# Altium schematic sheet ESP32_USB_C.SchDoc (part 3 of 3)
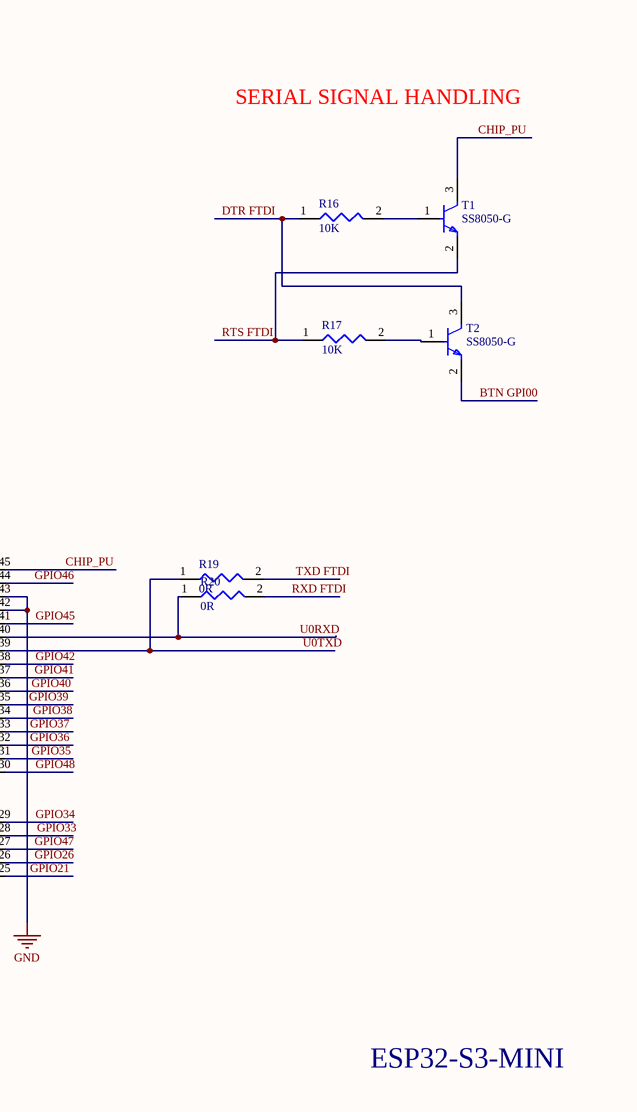
[diagram p5: ESP32_USB_C.SchDoc, bottom right]

## Library data of the parts (continued)
R1-R3 R19-R24 = RC0402JR-070RL: GENERAL PURPOSE CHIP RESISTOR Metal Glaze/thick Film, 0.0625W, 0ohm, Surface Mount, 0402; Manufacturer: Yageo Group; Max Power Dissipation: 63mW; Power Rating: 62.5mW; Value: 0Ω; Temperature Coefficient: 200ppm/°C; Tolerance: 5%; Voltage Rating: 50V; Supplier: DigiKey; Supplier Part Number: 311-0.0JRDKR-ND; Manufacturer Part Number: RC0402JR-070RL; RoHS: Compliant; Category: Chip SMD Resistors; Stock: 12335532; Pricing: 1=0.1, 10=0.010, 25=0.0064, 50=0.0056, 100=0.0048, 250=0.00404, 500=0.00356, 1000=0.00313, 5000=0.00237 (USD); Case/Package: 0402; Case Code (Imperial): 0402; China RoHS: Non-Compliant; Composition: Thick Film; Contact Plating: Tin; Depth: 500µm; Features: Moisture Resistant; Height: 350µm; Lead Free: Lead Free; Length: 1mm; Lifecycle Status: Production; Max Operating Temperature: 155°C; Military Standard: Not; Min Operating Temperature: -55°C; Mounting Technology: Surface Mount; Pins: 2; Number of Terminals: 2; Number of Terminations: 2; Packaging: Tape & Reel; Radiation Hardening: No; REACH SVHC: Yes; Schedule B: 8533290000, 8533290000|8533290000, 8533290000|8533290000|8533290000, 8533290000|8533290000|8533290000|8533290000; Termination: SMD/SMT; Voltage Rating (DC): 50V; Width: 500µm; ComponentLink1URL: https://datasheet.octopart.com:443/RC0402JR-070RL-Yageo-datasheet-182189538.pdf?src-supplier=IHS; ComponentLink1Description: https://datasheet.octopart.com:443/RC0402JR-070RL-Yageo-datasheet-182189538.pdf?src-supplier=IHS; ComponentLink2URL: https://datasheet.octopart.com:443/RC0402JR-070RL-Yageo-datasheet-10408619.pdf?src-supplier=Newark; ComponentLink2Description: https://datasheet.octopart.com:443/RC0402JR-070RL-Yageo-datasheet-10408619.pdf?src-supplier=Newark; ComponentLink3URL: https://datasheet.octopart.com:443/RC0402JR-070RL-Yageo-Group-datasheet-181964826.pdf?src-supplier=Newark; ComponentLink3Description: https://datasheet.octopart.com:443/RC0402JR-070RL-Yageo-Group-datasheet-181964826.pdf?src-supplier=Newark; ComponentLink4URL: https://datasheet.octopart.com:443/RC0402JR-070RL-Yageo-Group-datasheet-190305687.pdf?src-supplier=Future+Electronics; ComponentLink4Description: https://datasheet.octopart.com:443/RC0402JR-070RL-Yageo-Group-datasheet-190305687.pdf?src-supplier=Future+Electronics; ComponentLink5URL: https://datasheet.octopart.com:443/RC0402JR-070RL-Yageo-datasheet-164759695.pdf?src-supplier=Future+Electronics; ComponentLink5Description: https://datasheet.octopart.com:443/RC0402JR-070RL-Yageo-datasheet-164759695.pdf?src-supplier=Future+Electronics; ComponentLink6URL: https://datasheet.octopart.com:443/RC0402JR-070RL-Yageo-datasheet-137700087.pdf?src-supplier=Future+Electronics; ComponentLink6Description: https://datasheet.octopart.com:443/RC0402JR-070RL-Yageo-datasheet-137700087.pdf?src-supplier=Future+Electronics; ComponentLink7URL: https://datasheet.octopart.com:443/RC0402JR-070RL-Yageo-datasheet-12531192.pdf?src-supplier=Seeed+Studio; ComponentLink7Description: https://datasheet.octopart.com:443/RC0402JR-070RL-Yageo-datasheet-12531192.pdf?src-supplier=Seeed+Studio; ComponentLink8URL: https://datasheet.octopart.com:443/RC0402JR-070RL-Yageo-datasheet-8324527.pdf?src-supplier=TME; ComponentLink8Description: https://datasheet.octopart.com:443/RC0402JR-070RL-Yageo-datasheet-8324527.pdf?src-supplier=TME; ComponentLink9URL: https://datasheet.octopart.com:443/RC0402JR-070RL-Yageo-datasheet-62067350.pdf?src-supplier=Farnell; ComponentLink9Description: https://datasheet.octopart.com:443/RC0402JR-070RL-Yageo-datasheet-62067350.pdf?src-supplier=Farnell; ComponentLink10URL: https://datasheet.octopart.com:443/RC0402JR-070RL-Yageo-datasheet-8329306.pdf?src-supplier=element14; ComponentLink10Description: https://datasheet.octopart.com:443/RC0402JR-070RL-Yageo-datasheet-8329306.pdf?src-supplier=element14; ComponentLink11URL: https://datasheet.octopart.com:443/RC0402JR-070RL-Yageo-datasheet-505231.pdf?src-supplier=element14; ComponentLink11Description: https://datasheet.octopart.com:443/RC0402JR-070RL-Yageo-datasheet-505231.pdf?src-supplier=element14; ComponentLink12URL: https://datasheet.octopart.com:443/RC0402JR-070RL-Yageo-datasheet-175423674.pdf?src-supplier=SOS+electronic; ComponentLink12Description: https://datasheet.octopart.com:443/RC0402JR-070RL-Yageo-datasheet-175423674.pdf?src-supplier=SOS+electronic; ComponentLink13URL: https://datasheet.octopart.com/RC0402JR-070RL-Yageo-datasheet-73766026.pdf; ComponentLink13Description: https://datasheet.octopart.com/RC0402JR-070RL-Yageo-datasheet-73766026.pdf; ComponentLink14URL: http://sigma.octopart.com:80/conflict_mineral_statement/Yageo-company-3.pdf?src-supplier=Compliance+Statements; ComponentLink14Description: http://sigma.octopart.com:80/conflict_mineral_statement/Yageo-company-3.pdf?src-supplier=Compliance+Statements; ComponentLink15URL: http://sigma.octopart.com:80/rohs_statement/Yageo-company-2.pdf?src-supplier=Compliance+Statements; ComponentLink15Description: http://sigma.octopart.com:80/rohs_statement/Yageo-company-2.pdf?src-supplier=Compliance+Statements
R4 R6 = AC0603FR-101KL: Fixed Resistor, Metal Glaze/thick Film, 0.1W, 1000ohm, 75V, 1% +/-Tol, 100ppm/Cel, Surface Mount, 0603; Manufacturer: Yageo Group; Power Rating: 100mW; Value: 1kΩ; Temperature Coefficient: 100ppm/°C; Supplier: DigiKey; Supplier Part Number: 13-AC0603FR-101KLDKR-ND; Manufacturer Part Number: AC0603FR-101KL; RoHS: Compliant; Category: Chip SMD Resistors; Stock: 46779; Pricing: 1=0.1, 10=0.028, 25=0.0204, 50=0.0164, 100=0.0134, 250=0.01036, 500=0.00868, 1000=0.00735, 5000=0.00527 (USD); Case/Package: 0603; Case Code (Imperial): 0603; Case Code (Metric): 1608; China RoHS: Non-Compliant; Composition: Thick Film; Country of Origin: Mainland China, Taiwan; Export Control Classification Number (ECCN) Code: EAR99; Height: 450µm; Harmonized Tariff Schedule (HTS) Code: 8533.21.00.30; Introduction Date: 2012-04-10; Length: 1.6mm; Lifecycle Status: Production; Max Operating Temperature: 155°C; Min Operating Temperature: -55°C; Mounting Technology: Surface Mount; Number of Terminals: 2; Packaging: Tape & Reel; Ratings: AEC-Q200; REACH SVHC: Yes; Termination: SMD/SMT; Tolerance: 1%; Voltage Rating: 75V; Width: 800µm; Working Voltage: 75V; ComponentLink1URL: https://datasheet.octopart.com:443/AC0603FR-101KL-Yageo-datasheet-182189377.pdf?src-supplier=IHS; ComponentLink1Description: https://datasheet.octopart.com:443/AC0603FR-101KL-Yageo-datasheet-182189377.pdf?src-supplier=IHS; ComponentLink2URL: https://datasheet.octopart.com:443/AC0603FR-101KL-Yageo-datasheet-86786639.pdf?src-supplier=Upverter; ComponentLink2Description: https://datasheet.octopart.com:443/AC0603FR-101KL-Yageo-datasheet-86786639.pdf?src-supplier=Upverter; ComponentLink3URL: https://datasheet.octopart.com:443/AC0603FR-101KL-Yageo-datasheet-178509465.pdf?src-supplier=Newark; ComponentLink3Description: https://datasheet.octopart.com:443/AC0603FR-101KL-Yageo-datasheet-178509465.pdf?src-supplier=Newark; ComponentLink4URL: https://datasheet.octopart.com:443/AC0603FR-101KL-Yageo-datasheet-166720450.pdf?src-supplier=Future+Electronics; ComponentLink4Description: https://datasheet.octopart.com:443/AC0603FR-101KL-Yageo-datasheet-166720450.pdf?src-supplier=Future+Electronics; ComponentLink5URL: https://datasheet.octopart.com:443/AC0603FR-101KL-Yageo-datasheet-164768995.pdf?src-supplier=Future+Electronics; ComponentLink5Description: https://datasheet.octopart.com:443/AC0603FR-101KL-Yageo-datasheet-164768995.pdf?src-supplier=Future+Electronics; ComponentLink6URL: https://datasheet.octopart.com/AC0603FR-101KL-Yageo-datasheet-12512238.pdf; ComponentLink6Description: https://datasheet.octopart.com/AC0603FR-101KL-Yageo-datasheet-12512238.pdf; ComponentLink7URL: http://sigma.octopart.com:80/conflict_mineral_statement/Yageo-company-3.pdf?src-supplier=Compliance+Statements; ComponentLink7Description: http://sigma.octopart.com:80/conflict_mineral_statement/Yageo-company-3.pdf?src-supplier=Compliance+Statements; ComponentLink8URL: http://sigma.octopart.com:80/rohs_statement/Yageo-company-2.pdf?src-supplier=Compliance+Statements; ComponentLink8Description: http://sigma.octopart.com:80/rohs_statement/Yageo-company-2.pdf?src-supplier=Compliance+Statements
R5 R8 R25 R26 = RC0402FR-0727RL: 62.5mW Thick Film Resistors 50V ±100ppm/℃ ±1% 27Ω 0402 Chip Resistor - Surface Mount ROHS; Manufacturer: Yageo Group; Max Power Dissipation: 63mW; Temperature Coefficient: 100ppm/°C; Supplier: DigiKey; Supplier Part Number: YAG3086TR-ND; Manufacturer Part Number: RC0402FR-0727RL; RoHS: Compliant; Category: Chip SMD Resistors; Stock: 137651; Pricing: 10000=0.0031, 20000=0.00275, 30000=0.00257, 50000=0.00239, 70000=0.00228, 100000=0.00218 (USD); Case/Package: 0402; Case Code (Imperial): 0402; Case Code (Metric): 1005; China RoHS: Non-Compliant; Composition: Thick Film; Country of Origin: Mainland China, Taiwan; Depth: 500µm; Export Control Classification Number (ECCN) Code: EAR99; Features: Moisture Resistant; Height: 350µm; Harmonized Tariff Schedule (HTS) Code: 8533.21.00.30; Introduction Date: 2008-07-18; Lead Free: Lead Free; Length: 1mm; Lifecycle Status: Production; Max Operating Temperature: 155°C; Military Standard: Not; Min Operating Temperature: -55°C; Mounting Technology: Surface Mount; Pins: 2; Number of Terminals: 2; Number of Terminations: 2; Power Rating: 62.5mW; REACH SVHC: Yes; Value: 27Ω; Schedule B: 8533210045, 8533210045|8533210045, 8533210045|8533210045|8533210045, 8533210045|8533210045|8533210045|8533210045; Termination: SMD/SMT; Tolerance: 1%; Voltage Rating: 50V; Voltage Rating (AC): 50V; Voltage Rating (DC): 50V; Weight: 652.039032µg; Width: 500µm; Working Voltage: 50V; ComponentLink1URL: https://datasheet.octopart.com:443/RC0402FR-0727RL-Yageo-datasheet-175887523.pdf?src-supplier=Newark; ComponentLink1Description: https://datasheet.octopart.com:443/RC0402FR-0727RL-Yageo-datasheet-175887523.pdf?src-supplier=Newark; ComponentLink2URL: https://datasheet.octopart.com:443/RC0402FR-0727RL-Yageo-datasheet-8324527.pdf?src-supplier=Newark; ComponentLink2Description: https://datasheet.octopart.com:443/RC0402FR-0727RL-Yageo-datasheet-8324527.pdf?src-supplier=Newark; ComponentLink3URL: https://datasheet.octopart.com:443/RC0402FR-0727RL-Yageo-datasheet-103092701.pdf?src-supplier=Upverter; ComponentLink3Description: https://datasheet.octopart.com:443/RC0402FR-0727RL-Yageo-datasheet-103092701.pdf?src-supplier=Upverter; ComponentLink4URL: https://datasheet.octopart.com:443/RC0402FR-0727RL-Yageo-datasheet-10408619.pdf?src-supplier=element14+APAC; ComponentLink4Description: https://datasheet.octopart.com:443/RC0402FR-0727RL-Yageo-datasheet-10408619.pdf?src-supplier=element14+APAC; ComponentLink5URL: https://datasheet.octopart.com:443/RC0402FR-0727RL-Yageo-datasheet-62067350.pdf?src-supplier=element14+APAC; ComponentLink5Description: https://datasheet.octopart.com:443/RC0402FR-0727RL-Yageo-datasheet-62067350.pdf?src-supplier=element14+APAC; ComponentLink6URL: https://datasheet.octopart.com:443/RC0402FR-0727RL-Yageo-Group-datasheet-189192902.pdf?src-supplier=LCSC; ComponentLink6Description: https://datasheet.octopart.com:443/RC0402FR-0727RL-Yageo-Group-datasheet-189192902.pdf?src-supplier=LCSC; ComponentLink7URL: https://datasheet.octopart.com:443/RC0402FR-0727RL-Yageo-Group-datasheet-176638170.pdf?src-supplier=Future+Electronics; ComponentLink7Description: https://datasheet.octopart.com:443/RC0402FR-0727RL-Yageo-Group-datasheet-176638170.pdf?src-supplier=Future+Electronics; ComponentLink8URL: https://datasheet.octopart.com:443/RC0402FR-0727RL-Yageo-datasheet-164759695.pdf?src-supplier=Future+Electronics; ComponentLink8Description: https://datasheet.octopart.com:443/RC0402FR-0727RL-Yageo-datasheet-164759695.pdf?src-supplier=Future+Electronics; ComponentLink9URL: https://datasheet.octopart.com:443/RC0402FR-0727RL-Yageo-datasheet-137700087.pdf?src-supplier=Future+Electronics; ComponentLink9Description: https://datasheet.octopart.com:443/RC0402FR-0727RL-Yageo-datasheet-137700087.pdf?src-supplier=Future+Electronics; ComponentLink10URL: https://datasheet.octopart.com:443/RC0402FR-0727RL-Yageo-datasheet-12531192.pdf?src-supplier=Future+Electronics; ComponentLink10Description: https://datasheet.octopart.com:443/RC0402FR-0727RL-Yageo-datasheet-12531192.pdf?src-supplier=Future+Electronics; ComponentLink11URL: https://datasheet.octopart.com:443/RC0402FR-0727RL-Yageo-datasheet-175423674.pdf?src-supplier=SOS+electronic; ComponentLink11Description: https://datasheet.octopart.com:443/RC0402FR-0727RL-Yageo-datasheet-175423674.pdf?src-supplier=SOS+electronic; ComponentLink12URL: https://datasheet.octopart.com:443/RC0402FR-0727RL-Yageo-datasheet-8329306.pdf?src-supplier=SOS+electronic; ComponentLink12Description: https://datasheet.octopart.com:443/RC0402FR-0727RL-Yageo-datasheet-8329306.pdf?src-supplier=SOS+electronic; ComponentLink13URL: https://datasheet.octopart.com:443/RC0402FR-0727RL-Yageo-datasheet-148775077.pdf?src-supplier=TME; ComponentLink13Description: https://datasheet.octopart.com:443/RC0402FR-0727RL-Yageo-datasheet-148775077.pdf?src-supplier=TME; ComponentLink14URL: https://datasheet.octopart.com/RC0402FR-0727RL-Yageo-datasheet-73766026.pdf; ComponentLink14Description: https://datasheet.octopart.com/RC0402FR-0727RL-Yageo-datasheet-73766026.pdf; ComponentLink15URL: http://sigma.octopart.com:80/conflict_mineral_statement/Yageo-company-3.pdf?src-supplier=Compliance+Statements; ComponentLink15Description: http://sigma.octopart.com:80/conflict_mineral_statement/Yageo-company-3.pdf?src-supplier=Compliance+Statements; ComponentLink16URL: http://sigma.octopart.com:80/rohs_statement/Yageo-company-2.pdf?src-supplier=Compliance+Statements; ComponentLink16Description: http://sigma.octopart.com:80/rohs_statement/Yageo-company-2.pdf?src-supplier=Compliance+Statements
R7 = 6-1879336-2: Fixed Resistor, Thin Film, 0.063W, 1000ohm, 50V, 1% +/-Tol, 50ppm/Cel, Surface Mount, 0603; Manufacturer: TE Connectivity; Manufacturer Lifecycle Status: ACTIVE; Max Power Dissipation: 63mW; Number of Resistors: 1; Value: 1kΩ; Temperature Coefficient: 50ppm/°C; Supplier: DigiKey; Supplier Part Number: A102226CT-ND; Manufacturer Part Number: 6-1879336-2; RoHS: Compliant; Category: Chip SMD Resistors; Stock: 101651; Pricing: 1=0.1, 10=0.044, 25=0.0404, 50=0.0382, 100=0.0361, 250=0.03352, 500=0.03168 (USD); Case/Package: 0603; Case Code (Imperial): 0603; Case Code (Metric): 1608; China RoHS: Compliant; Composition: Thin Film; Contact Plating: Tin; Depth: 800µm; Export Control Classification Number (ECCN) Code: EAR99; ELV: Compliant; Height: 450µm; Harmonized Tariff Schedule (HTS) Code: 8533.21.00.30; Introduction Date: 2011-07-28; Length: 1.55mm; Lifecycle Status: Production; Max Operating Temperature: 155°C; Military Standard: Not; Min Operating Temperature: -55°C; Mounting Technology: Surface Mount; Pins: 2; Number of Terminals: 2; Number of Terminations: 2; Operating Supply Voltage: 50V; Power Rating: 63mW; Radiation Hardening: No; REACH SVHC: Yes; Schedule B: 8533210045, 8533210080, 8533210080|8533210080, 8533210080|8533210080|8533210080; Termination: Solder; Tolerance: 1%; Voltage Rating: 50V; Voltage Rating (DC): 50V; Weight: 2.012816mg; Width: 800µm; Working Voltage: 50V; ComponentLink1URL: https://datasheet.octopart.com:443/6-1879336-2-TE-Connectivity-datasheet-158231717.pdf?src-supplier=IHS; ComponentLink1Description: https://datasheet.octopart.com:443/6-1879336-2-TE-Connectivity-datasheet-158231717.pdf?src-supplier=IHS; ComponentLink2URL: https://datasheet.octopart.com:443/CPF0603F1K0C1-TE-Connectivity-datasheet-136771900.pdf?src-supplier=Electro+Sonic; ComponentLink2Description: https://datasheet.octopart.com:443/CPF0603F1K0C1-TE-Connectivity-datasheet-136771900.pdf?src-supplier=Electro+Sonic; ComponentLink3URL: https://datasheet.octopart.com:443/CPF0603F1K0C1-Tyco-Electronics-datasheet-11120073.pdf?src-supplier=TE+Connectivity; ComponentLink3Description: https://datasheet.octopart.com:443/CPF0603F1K0C1-Tyco-Electronics-datasheet-11120073.pdf?src-supplier=TE+Connectivity; ComponentLink4URL: https://datasheet.octopart.com:443/6-1879336-2-TE-Connectivity-datasheet-78339074.pdf?src-supplier=TE+Connectivity; ComponentLink4Description: https://datasheet.octopart.com:443/6-1879336-2-TE-Connectivity-datasheet-78339074.pdf?src-supplier=TE+Connectivity; ComponentLink5URL: https://datasheet.octopart.com:443/CPF0603F1K0C1-Tyco-Electronics-datasheet-13547235.pdf?src-supplier=TE+Connectivity; ComponentLink5Description: https://datasheet.octopart.com:443/CPF0603F1K0C1-Tyco-Electronics-datasheet-13547235.pdf?src-supplier=TE+Connectivity; ComponentLink6URL: https://datasheet.octopart.com:443/CPF0603F1K0C1-Tyco-Electronics-datasheet-11120060.pdf?src-supplier=Newark; ComponentLink6Description: https://datasheet.octopart.com:443/CPF0603F1K0C1-Tyco-Electronics-datasheet-11120060.pdf?src-supplier=Newark; ComponentLink7URL: https://datasheet.octopart.com:443/CPF0603F1K0C1-Tyco-Electronics-datasheet-5303618.pdf?src-supplier=Newark; ComponentLink7Description: https://datasheet.octopart.com:443/CPF0603F1K0C1-Tyco-Electronics-datasheet-5303618.pdf?src-supplier=Newark; ComponentLink8URL: https://datasheet.octopart.com:443/CPF0603F1K0C1-Tyco-Electronics-datasheet-5299551.pdf?src-supplier=Newark; ComponentLink8Description: https://datasheet.octopart.com:443/CPF0603F1K0C1-Tyco-Electronics-datasheet-5299551.pdf?src-supplier=Newark; ComponentLink9URL: https://datasheet.octopart.com:443/CPF0603F1K0C1-Holsworthy-datasheet-11120284.pdf?src-supplier=JRH+Electronics; ComponentLink9Description: https://datasheet.octopart.com:443/CPF0603F1K0C1-Holsworthy-datasheet-11120284.pdf?src-supplier=JRH+Electronics; ComponentLink10URL: https://datasheet.octopart.com:443/CPF0603F1K0C1-TE-Connectivity---Neohm-datasheet-193183182.pdf?src-supplier=JRH+Electronics; ComponentLink10Description: https://datasheet.octopart.com:443/CPF0603F1K0C1-TE-Connectivity---Neohm-datasheet-193183182.pdf?src-supplier=JRH+Electronics; ComponentLink11URL: https://datasheet.octopart.com:443/6-1879336-2-TE-Connectivity---AMP-datasheet-189108484.pdf?src-supplier=JRH+Electronics; ComponentLink11Description: https://datasheet.octopart.com:443/6-1879336-2-TE-Connectivity---AMP-datasheet-189108484.pdf?src-supplier=JRH+Electronics; ComponentLink12URL: https://datasheet.octopart.com:443/CPF0603F1K0C1-TE-Connectivity-datasheet-78339038.pdf?src-supplier=Master+Electronics; ComponentLink12Description: https://datasheet.octopart.com:443/CPF0603F1K0C1-TE-Connectivity-datasheet-78339038.pdf?src-supplier=Master+Electronics; ComponentLink13URL: https://datasheet.octopart.com:443/6-1879336-2-AMP-datasheet-62056503.pdf?src-supplier=Master+Electronics; ComponentLink13Description: https://datasheet.octopart.com:443/6-1879336-2-AMP-datasheet-62056503.pdf?src-supplier=Master+Electronics; ComponentLink14URL: https://datasheet.octopart.com:443/CPF0603F1K0C1-Neohm-datasheet-17911634.pdf?src-supplier=Master+Electronics; ComponentLink14Description: https://datasheet.octopart.com:443/CPF0603F1K0C1-Neohm-datasheet-17911634.pdf?src-supplier=Master+Electronics; ComponentLink15URL: https://datasheet.octopart.com:443/CPF0603F1K0C1-Neohm-datasheet-140860410.pdf?src-supplier=Master+Electronics; ComponentLink15Description: https://datasheet.octopart.com:443/CPF0603F1K0C1-Neohm-datasheet-140860410.pdf?src-supplier=Master+Electronics; ComponentLink16URL: https://datasheet.octopart.com:443/6-1879336-2-TE-Connectivity---AMP-datasheet-187588164.pdf?src-supplier=Master+Electronics; ComponentLink16Description: https://datasheet.octopart.com:443/6-1879336-2-TE-Connectivity---AMP-datasheet-187588164.pdf?src-supplier=Master+Electronics; ComponentLink17URL: https://datasheet.octopart.com:443/CPF0603F1K0C1-TE-Connectivity-datasheet-62316152.pdf?src-supplier=Farnell; ComponentLink17Description: https://datasheet.octopart.com:443/CPF0603F1K0C1-TE-Connectivity-datasheet-62316152.pdf?src-supplier=Farnell; ComponentLink18URL: https://datasheet.octopart.com:443/6-1879336-2-TE-Connectivity-datasheet-184401518.pdf?src-supplier=Farnell; ComponentLink18Description: https://datasheet.octopart.com:443/6-1879336-2-TE-Connectivity-datasheet-184401518.pdf?src-supplier=Farnell; ComponentLink19URL: https://datasheet.octopart.com:443/CPF0603F1K0C1-Tyco-Electronics-datasheet-12510971.pdf?src-supplier=Farnell; ComponentLink19Description: https://datasheet.octopart.com:443/CPF0603F1K0C1-Tyco-Electronics-datasheet-12510971.pdf?src-supplier=Farnell; ComponentLink20URL: https://datasheet.octopart.com:443/6-1879336-2-TE-Connectivity-datasheet-137108763.pdf?src-supplier=X-ON; ComponentLink20Description: https://datasheet.octopart.com:443/6-1879336-2-TE-Connectivity-datasheet-137108763.pdf?src-supplier=X-ON; ComponentLink21URL: http://sigma.octopart.com:80/14739306/rohs_certificate/Holsworthy-CPF0603F1K0C1.pdf?src-supplier=Compliance+Statements; ComponentLink21Description: http://sigma.octopart.com:80/14739306/rohs_certificate/Holsworthy-CPF0603F1K0C1.pdf?src-supplier=Compliance+Statements
R9 R13 = CRGCQ2512F4K7: Res Thick Film 2512 4.7K Ohm 1% 1W ±100ppm/C Pad SMD T/R Automotive AEC-Q200; Manufacturer: TE Connectivity; Manufacturer Lifecycle Status: ACTIVE; Operating Supply Voltage: 200V; Value: 4.7kΩ; Temperature Coefficient: 100ppm/°C; Supplier: DigiKey; Supplier Part Number: A130001DKR-ND; Manufacturer Part Number: CRGCQ2512F4K7; RoHS: Compliant; Category: Chip SMD Resistors; Stock: 26193; Pricing: 1=0.43, 10=0.241, 25=0.1992, 50=0.1752, 100=0.156, 250=0.13672, 500=0.12558, 1000=0.11671 (USD); Case/Package: 2512; China RoHS: Compliant; Composition: Thick Film; Export Control Classification Number (ECCN) Code: EAR99; Height: 550µm; Harmonized Tariff Schedule (HTS) Code: 8533.21.00.30; Introduction Date: 2018-03-13; Length: 6.35mm; Lifecycle Status: Production; Max Operating Temperature: 155°C; Min Operating Temperature: -55°C; Mounting Technology: Surface Mount; Number of Terminals: 2; Packaging: Cut Tape; Power Rating: 1W; Ratings: AEC-Q200; REACH SVHC: Yes; Schedule B: 8533210025, 8533210025|8533210025|8533210025|8533210025|8533210025, 8533210045; Tolerance: 1%; Voltage Rating: 200V; Voltage Rating (DC): 200V; Width: 3.2mm; Working Voltage: 200V; ComponentLink1URL: https://datasheet.octopart.com:443/CRGCQ2512F4K7-TE-Connectivity-datasheet-114679081.pdf?src-supplier=Master+Electronics; ComponentLink1Description: https://datasheet.octopart.com:443/CRGCQ2512F4K7-TE-Connectivity-datasheet-114679081.pdf?src-supplier=Master+Electronics; ComponentLink2URL: https://datasheet.octopart.com:443/CRGCQ2512F4K7-TE-Connectivity-datasheet-179161934.pdf?src-supplier=IHS; ComponentLink2Description: https://datasheet.octopart.com:443/CRGCQ2512F4K7-TE-Connectivity-datasheet-179161934.pdf?src-supplier=IHS; ComponentLink3URL: https://sigma.octopart.com:443/114717093/technical_drawing/TE-Connectivity-CRGCQ2512F4K7.pdf?src-supplier=Sager+Electronics; ComponentLink3Description: https://sigma.octopart.com:443/114717093/technical_drawing/TE-Connectivity-CRGCQ2512F4K7.pdf?src-supplier=Sager+Electronics; ComponentLink4URL: http://sigma.octopart.com:80/169816580/materials_sheet/TE-Connectivity-CRGCQ2512F4K7.csv?src-supplier=Compliance+Statements; ComponentLink4Description: http://sigma.octopart.com:80/169816580/materials_sheet/TE-Connectivity-CRGCQ2512F4K7.csv?src-supplier=Compliance+Statements
R10 R11 R14 R15 = ERJ2RKF5101X: Res Thick Film 0402 5.1K Ohm 1% 0.1W(1/10W) ±100ppm/C Pad SMD Automotive T/R; Manufacturer: Panasonic; Manufacturer Lifecycle Status: ACTIVE; Part Series: Precision Thick Film Chip Resistors; Max Power Dissipation: 100mW; Value: 5.1kΩ; Temperature Coefficient: 100ppm/°C; Voltage Rating: 50V; Supplier: DigiKey; Supplier Part Number: P5.10KLDKR-ND; Manufacturer Part Number: ERJ2RKF5101X; RoHS: Compliant; Category: Chip SMD Resistors; Stock: 567024; Pricing: 1=0.1, 10=0.031, 25=0.0232, 50=0.0188, 100=0.0155, 250=0.01208, 500=0.01018, 1000=0.00868, 5000=0.00631 (USD); Case/Package: 0402; Case Code (Imperial): 0402; Case Code (Metric): 1005; China RoHS: Non-Compliant; Composition: Thick Film; Contact Plating: Tin; Country of Origin: Japan, Mainland China; Depth: 500µm; Export Control Classification Number (ECCN) Code: EAR99; Height: 350µm; Harmonized Tariff Schedule (HTS) Code: 8533.21.00.30; Introduction Date: 2002-02-12; Lead Free: Lead Free; Length: 1mm; Lifecycle Status: Production; Max Operating Temperature: 155°C; Military Standard: Not; Min Operating Temperature: -55°C; Mounting Technology: Surface Mount; Number of Terminals: 2; Number of Terminations: 2; Packaging: Cut Tape; Power Rating: 100mW; Ratings: AEC-Q200; REACH SVHC: Yes; Schedule B: 8533210045, 8533210045|8533210045|8533210045|8533210045|8533210045|8533210045|8533210045|8533210045|8533210045, 8533210045|8533210045|8533210045|8533210045|8533210045|8533210045|8533210045|8533210045|8533210045|8533210045, 8533210045|8533210045|8533210045|8533210045|8533210045|8533210045|8533210045|8533210045|8533210045|8533210045|8533210045; Termination: SMD/SMT; Tolerance: 1%; Voltage Rating (DC): 50V; Weight: 793.786648µg; Width: 500µm; Working Voltage: 50V; ComponentLink1URL: https://datasheet.octopart.com:443/ERJ2RKF5101X-Panasonic-datasheet-182147282.pdf?src-supplier=IHS; ComponentLink1Description: https://datasheet.octopart.com:443/ERJ2RKF5101X-Panasonic-datasheet-182147282.pdf?src-supplier=IHS; ComponentLink2URL: https://datasheet.octopart.com:443/ERJ2RKF5101X-Panasonic-datasheet-82288794.pdf?src-supplier=Upverter; ComponentLink2Description: https://datasheet.octopart.com:443/ERJ2RKF5101X-Panasonic-datasheet-82288794.pdf?src-supplier=Upverter; ComponentLink3URL: https://datasheet.octopart.com:443/ERJ2RKF5101X-Panasonic-datasheet-48891056.pdf?src-supplier=Newark; ComponentLink3Description: https://datasheet.octopart.com:443/ERJ2RKF5101X-Panasonic-datasheet-48891056.pdf?src-supplier=Newark; ComponentLink4URL: https://datasheet.octopart.com:443/ERJ2RKF5101X-Panasonic-datasheet-136608610.pdf?src-supplier=Newark; ComponentLink4Description: https://datasheet.octopart.com:443/ERJ2RKF5101X-Panasonic-datasheet-136608610.pdf?src-supplier=Newark; ComponentLink5URL: https://datasheet.octopart.com:443/ERJ2RKF5101X-Panasonic-datasheet-33006990.pdf?src-supplier=Newark; ComponentLink5Description: https://datasheet.octopart.com:443/ERJ2RKF5101X-Panasonic-datasheet-33006990.pdf?src-supplier=Newark; ComponentLink6URL: https://datasheet.octopart.com:443/ERJ-2RKF5101X-Panasonic---ECG-datasheet-21211697.pdf?src-supplier=Newark; ComponentLink6Description: https://datasheet.octopart.com:443/ERJ-2RKF5101X-Panasonic---ECG-datasheet-21211697.pdf?src-supplier=Newark; ComponentLink7URL: https://datasheet.octopart.com:443/ERJ2RKF5101X-Panasonic-datasheet-13266541.pdf?src-supplier=RS+(Formerly+Allied+Electronics); ComponentLink7Description: https://datasheet.octopart.com:443/ERJ2RKF5101X-Panasonic-datasheet-13266541.pdf?src-supplier=RS+(Formerly+Allied+Electronics); ComponentLink8URL: https://datasheet.octopart.com:443/ERJ-2RKF5101X-Panasonic-datasheet-154766169.pdf?src-supplier=Master+Electronics; ComponentLink8Description: https://datasheet.octopart.com:443/ERJ-2RKF5101X-Panasonic-datasheet-154766169.pdf?src-supplier=Master+Electronics; ComponentLink9URL: https://datasheet.octopart.com:443/ERJ2RKF5101X-Panasonic-datasheet-188592431.pdf?src-supplier=TME; ComponentLink9Description: https://datasheet.octopart.com:443/ERJ2RKF5101X-Panasonic-datasheet-188592431.pdf?src-supplier=TME; ComponentLink10URL: https://datasheet.octopart.com:443/ERJ2RKF5101X-Panasonic-datasheet-164353789.pdf?src-supplier=TME; ComponentLink10Description: https://datasheet.octopart.com:443/ERJ2RKF5101X-Panasonic-datasheet-164353789.pdf?src-supplier=TME; ComponentLink11URL: https://datasheet.octopart.com/ERJ2RKF5101X-Panasonic-datasheet-78375410.pdf; ComponentLink11Description: https://datasheet.octopart.com/ERJ2RKF5101X-Panasonic-datasheet-78375410.pdf; ComponentLink12URL: https://datasheet.octopart.com:443/ERJ-2RKF5101X-Panasonic---ECG-datasheet-15994758.pdf?src-supplier=Farnell; ComponentLink12Description: https://datasheet.octopart.com:443/ERJ-2RKF5101X-Panasonic---ECG-datasheet-15994758.pdf?src-supplier=Farnell; ComponentLink13URL: https://datasheet.octopart.com:443/ERJ-2RKF5101X-Panasonic---ECG-datasheet-10025800.pdf?src-supplier=Farnell; ComponentLink13Description: https://datasheet.octopart.com:443/ERJ-2RKF5101X-Panasonic---ECG-datasheet-10025800.pdf?src-supplier=Farnell; ComponentLink14URL: https://datasheet.octopart.com:443/ERJ-2RKF5101X-Panasonic---ECG-datasheet-8853621.pdf?src-supplier=Farnell; ComponentLink14Description: https://datasheet.octopart.com:443/ERJ-2RKF5101X-Panasonic---ECG-datasheet-8853621.pdf?src-supplier=Farnell; ComponentLink15URL: https://datasheet.octopart.com:443/ERJ-2RKF5101X-Panasonic---ECG-datasheet-5313456.pdf?src-supplier=Farnell; ComponentLink15Description: https://datasheet.octopart.com:443/ERJ-2RKF5101X-Panasonic---ECG-datasheet-5313456.pdf?src-supplier=Farnell; ComponentLink16URL: https://datasheet.octopart.com:443/ERJ-2RKF5101X-Panasonic-datasheet-41391857.pdf?src-supplier=Electro+Sonic; ComponentLink16Description: https://datasheet.octopart.com:443/ERJ-2RKF5101X-Panasonic-datasheet-41391857.pdf?src-supplier=Electro+Sonic
R12 R16 R17 = AC0603FR-7W10KL: Fixed Resistor, Metal Glaze/Thick Film, 0.2W, 10000ohm, 75V, 1% +/-Tol, Surface Mount, 0603; Manufacturer: Yageo Group; Power Rating: 200mW; Value: 10kΩ; Temperature Coefficient: 100ppm/°C; Supplier: DigiKey; Supplier Part Number: 13-AC0603FR-7W10KLCT-ND; Manufacturer Part Number: AC0603FR-7W10KL; RoHS: Compliant; Category: Chip SMD Resistors; Stock: 20427; Pricing: 1=0.1, 10=0.034, 25=0.0256, 50=0.0208, 100=0.0171, 250=0.0134, 500=0.01134, 1000=0.0097 (USD); Case/Package: 0603; China RoHS: Non-Compliant; Composition: Thick Film; Country of Origin: Mainland China, Taiwan; Export Control Classification Number (ECCN) Code: EAR99; Height: 450µm; Harmonized Tariff Schedule (HTS) Code: 8533.21.00.30; Introduction Date: 2017-06-20; Length: 1.6mm; Lifecycle Status: Production; Max Operating Temperature: 155°C; Min Operating Temperature: -55°C; Mounting Technology: Surface Mount; Number of Terminals: 2; Packaging: Tape & Reel; Ratings: AEC-Q200; REACH SVHC: Yes; Tolerance: 1%; Voltage Rating: 75V; Width: 800µm; Working Voltage: 75V; ComponentLink1URL: https://datasheet.octopart.com:443/AC0603FR-7W10KL-Yageo-datasheet-182189377.pdf?src-supplier=IHS; ComponentLink1Description: https://datasheet.octopart.com:443/AC0603FR-7W10KL-Yageo-datasheet-182189377.pdf?src-supplier=IHS; ComponentLink2URL: https://datasheet.octopart.com:443/AC0603FR-7W10KL-Yageo-datasheet-86786639.pdf?src-supplier=Upverter; ComponentLink2Description: https://datasheet.octopart.com:443/AC0603FR-7W10KL-Yageo-datasheet-86786639.pdf?src-supplier=Upverter; ComponentLink3URL: https://datasheet.octopart.com:443/AC0603FR-7W10KL-Yageo-datasheet-178509465.pdf?src-supplier=Farnell; ComponentLink3Description: https://datasheet.octopart.com:443/AC0603FR-7W10KL-Yageo-datasheet-178509465.pdf?src-supplier=Farnell; ComponentLink4URL: https://datasheet.octopart.com/AC0603FR-7W10KL-Yageo-datasheet-12512238.pdf; ComponentLink4Description: https://datasheet.octopart.com/AC0603FR-7W10KL-Yageo-datasheet-12512238.pdf; ComponentLink5URL: http://sigma.octopart.com:80/conflict_mineral_statement/Yageo-company-3.pdf?src-supplier=Compliance+Statements; ComponentLink5Description: http://sigma.octopart.com:80/conflict_mineral_statement/Yageo-company-3.pdf?src-supplier=Compliance+Statements; ComponentLink6URL: http://sigma.octopart.com:80/rohs_statement/Yageo-company-2.pdf?src-supplier=Compliance+Statements; ComponentLink6Description: http://sigma.octopart.com:80/rohs_statement/Yageo-company-2.pdf?src-supplier=Compliance+Statements
R18 = RC1005F103CS: Res Thick Film 0402 10K Ohm 1% 0.063W(1/16W) ±100ppm/°C Pad SMD T/R; Manufacturer: Samsung Electro-Mechanics; Max Power Dissipation: 63mW; Power Rating: 62.5mW; Value: 10kΩ; Voltage Rating: 50V; Supplier: DigiKey; Supplier Part Number: 1276-3431-2-ND; Manufacturer Part Number: RC1005F103CS; RoHS: Compliant; Category: Chip SMD Resistors; Stock: 4875384; Pricing: 10000=0.00854, 20000=0.00782, 30000=0.00746, 50000=0.00709, 70000=0.00687, 100000=0.00666 (USD); Case/Package: 0402; Case Code (Imperial): 0402; Case Code (Metric): 1005; China RoHS: Non-Compliant; Composition: Thick Film; Contact Plating: Tin; Country of Origin: Mainland China, Philippines, South Korea; Depth: 500µm; Export Control Classification Number (ECCN) Code: EAR99; Features: Moisture Resistant; Height: 350µm; Harmonized Tariff Schedule (HTS) Code: 8533.21.00.30; Introduction Date: 2008-04-14; Lead Free: Lead Free; Length: 1mm; Lifecycle Status: Production; Max Operating Temperature: 155°C; Military Standard: Not; Min Operating Temperature: -55°C; Mounting Technology: Surface Mount; Number of Terminals: 2; Number of Terminations: 2; Radiation Hardening: No; REACH SVHC: Yes; Schedule B: 8533210045, 8533210045|8533210045|8533210045|8533210045|8533210045; Temperature Coefficient: 100ppm/°C; Thickness: 350µm; Tolerance: 1%; Voltage Rating (DC): 50V; Width: 500µm; Working Voltage: 50V; ComponentLink1URL: https://datasheet.octopart.com:443/RC1005F103CS-Samsung-Electro-Mechanics-datasheet-141348306.pdf?src-supplier=IHS; ComponentLink1Description: https://datasheet.octopart.com:443/RC1005F103CS-Samsung-Electro-Mechanics-datasheet-141348306.pdf?src-supplier=IHS; ComponentLink2URL: https://datasheet.octopart.com/RC1005F103CS-Samsung-Electro-Mechanics-datasheet-41960856.pdf; ComponentLink2Description: https://datasheet.octopart.com/RC1005F103CS-Samsung-Electro-Mechanics-datasheet-41960856.pdf; ComponentLink3URL: https://datasheet.octopart.com:443/RC1005F103CS-Samsung-Electro-Mechanics-datasheet-128083940.pdf?src-supplier=Future+Electronics; ComponentLink3Description: https://datasheet.octopart.com:443/RC1005F103CS-Samsung-Electro-Mechanics-datasheet-128083940.pdf?src-supplier=Future+Electronics; ComponentLink4URL: https://datasheet.octopart.com:443/RC1005F103CS-Samsung-datasheet-12509865.pdf?src-supplier=Future+Electronics; ComponentLink4Description: https://datasheet.octopart.com:443/RC1005F103CS-Samsung-datasheet-12509865.pdf?src-supplier=Future+Electronics; ComponentLink5URL: https://datasheet.octopart.com:443/RC1005F103CS-Samsung-datasheet-22171951.pdf?src-supplier=Future+Electronics; ComponentLink5Description: https://datasheet.octopart.com:443/RC1005F103CS-Samsung-datasheet-22171951.pdf?src-supplier=Future+Electronics; ComponentLink6URL: https://datasheet.octopart.com:443/RC1005F103CS-Samsung-Electro-Mechanics-datasheet-11542935.pdf?src-supplier=Arrow+Electronics; ComponentLink6Description: https://datasheet.octopart.com:443/RC1005F103CS-Samsung-Electro-Mechanics-datasheet-11542935.pdf?src-supplier=Arrow+Electronics
SW1 SW2 = PTS645SM43SMTR92LFS: Switch Tactile N.O SPST Round Button Gull Wing 0.05A 12VDC 100000Cycle 1.57N SMD T/R; Manufacturer: C&K Components; Actuator Length: 850µm; Actuator Material: Nylon, Polyamide; Contact Current Rating: 50mA; Contact Resistance: 100mΩ; Electrical Life: 100kcycles; Illumination Type: Illuminated, Non-Illuminated; Insulation Resistance: 100GΩ; Max Voltage Rating (DC): 12V; Number of Positions: 1; Switch Function: Off-Mom; Supplier: DigiKey; Supplier Part Number: CKN9112CT-ND; Manufacturer Part Number: PTS645SM43SMTR92LFS; RoHS: Compliant; Category: Tactile Switches; Stock: 84628; Pricing: 1=0.36, 10=0.313, 25=0.2924, 100=0.2616, 250=0.24244, 500=0.22878 (USD); Case/Package: SMD/SMT; China RoHS: Compliant; Color: Black; Contact Material: Silver; Contact Plating: Silver; Current Rating: 50mA; Depth: 9mm; Height: 3.45mm; Lead Free: Lead Free; Length: 6mm; Life (Cycles): 100kcycles; Lifecycle Status: Production; Max Current Rating: 50mA; Max Operating Temperature: 60°C; Mechanical Life: 100kcycles; Manufacturer Package Identifier: PTS645SM43SMTR92LFS; Min Operating Temperature: -20°C; Mounting Technology: Surface Mount; Operating Force: 1.57N; Orientation: Straight; Packaging: Cut Tape (CT); REACH SVHC: Yes; Termination: Solder; Throw Configuration: SPST; Voltage Rating (DC): 12V; ComponentLink1URL: https://datasheet.octopart.com:443/PTS645SM43SMTR92LFS-C%26K-Components-datasheet-169841344.pdf?src-supplier=Newark; ComponentLink1Description: https://datasheet.octopart.com:443/PTS645SM43SMTR92LFS-C%26K-Components-datasheet-169841344.pdf?src-supplier=Newark; ComponentLink2URL: https://datasheet.octopart.com:443/PTS645SM43SMTR92LFS-C%26K-Components-datasheet-41191814.pdf?src-supplier=Newark; ComponentLink2Description: https://datasheet.octopart.com:443/PTS645SM43SMTR92LFS-C%26K-Components-datasheet-41191814.pdf?src-supplier=Newark; ComponentLink3URL: https://datasheet.octopart.com:443/PTS645SM43SMTR92LFS-C%26K-Components-datasheet-67873720.pdf?src-supplier=Upverter; ComponentLink3Description: https://datasheet.octopart.com:443/PTS645SM43SMTR92LFS-C%26K-Components-datasheet-67873720.pdf?src-supplier=Upverter; ComponentLink4URL: https://datasheet.octopart.com:443/PTS645SM43SMTR92-LFS-C%26K-Components-datasheet-39117004.pdf?src-supplier=Upverter; ComponentLink4Description: https://datasheet.octopart.com:443/PTS645SM43SMTR92-LFS-C%26K-Components-datasheet-39117004.pdf?src-supplier=Upverter; ComponentLink5URL: https://datasheet.octopart.com:443/PTS645SM43SMTR92LFS-C%26K-Components-datasheet-165782998.pdf?src-supplier=Farnell; ComponentLink5Description: https://datasheet.octopart.com:443/PTS645SM43SMTR92LFS-C%26K-Components-datasheet-165782998.pdf?src-supplier=Farnell; ComponentLink6URL: https://datasheet.octopart.com:443/PTS645SM43SMTR92LFS-C%26K-Components-datasheet-110647872.pdf?src-supplier=HQonline; ComponentLink6Description: https://datasheet.octopart.com:443/PTS645SM43SMTR92LFS-C%26K-Components-datasheet-110647872.pdf?src-supplier=HQonline; ComponentLink7URL: https://datasheet.octopart.com:443/PTS645SM43SMTR92LFS-C%26K-Components-datasheet-24578962.pdf?src-supplier=Future+Electronics; ComponentLink7Description: https://datasheet.octopart.com:443/PTS645SM43SMTR92LFS-C%26K-Components-datasheet-24578962.pdf?src-supplier=Future+Electronics; ComponentLink8URL: https://datasheet.octopart.com:443/PTS645SM43SMTR92LFS-C%26K-Components-datasheet-138128951.pdf?src-supplier=Future+Electronics; ComponentLink8Description: https://datasheet.octopart.com:443/PTS645SM43SMTR92LFS-C%26K-Components-datasheet-138128951.pdf?src-supplier=Future+Electronics; ComponentLink9URL: https://datasheet.octopart.com:443/PTS645SM43SMTR92LFS-C%26K-Components-datasheet-62111174.pdf?src-supplier=Future+Electronics; ComponentLink9Description: https://datasheet.octopart.com:443/PTS645SM43SMTR92LFS-C%26K-Components-datasheet-62111174.pdf?src-supplier=Future+Electronics; ComponentLink10URL: https://datasheet.octopart.com:443/PTS645SM43SMTR92-LFS-C%26K-Components-datasheet-5331042.pdf?src-supplier=Future+Electronics; ComponentLink10Description: https://datasheet.octopart.com:443/PTS645SM43SMTR92-LFS-C%26K-Components-datasheet-5331042.pdf?src-supplier=Future+Electronics; ComponentLink11URL: https://datasheet.octopart.com:443/PTS645SM43SMTR92LFS-C%26K-Components-datasheet-62111384.pdf?src-supplier=Electro+Sonic; ComponentLink11Description: https://datasheet.octopart.com:443/PTS645SM43SMTR92LFS-C%26K-Components-datasheet-62111384.pdf?src-supplier=Electro+Sonic; ComponentLink12URL: https://datasheet.octopart.com:443/PTS645SM43SMTR92-LFS-C%26K-Components-datasheet-23707823.pdf?src-supplier=Electro+Sonic; ComponentLink12Description: https://datasheet.octopart.com:443/PTS645SM43SMTR92-LFS-C%26K-Components-datasheet-23707823.pdf?src-supplier=Electro+Sonic; ComponentLink13URL: https://datasheet.octopart.com:443/PTS645SM43SMTR92LFS-C%26K-Components-datasheet-44395798.pdf?src-supplier=Electro+Sonic; ComponentLink13Description: https://datasheet.octopart.com:443/PTS645SM43SMTR92LFS-C%26K-Components-datasheet-44395798.pdf?src-supplier=Electro+Sonic; ComponentLink14URL: http://sigma.octopart.com:80/reach_statement/ITT-company-18.pdf?src-supplier=Compliance+Statements; ComponentLink14Description: http://sigma.octopart.com:80/reach_statement/ITT-company-18.pdf?src-supplier=Compliance+Statements
T1 T2 = SS8050-G: TRANS NPN 25V 1.5A SOT23-3 / Bipolar (BJT) Transistor NPN 25 V 1.5 A 100MHz 300 mW Surface Mount SOT-23-3; Manufacturer: Comchip; Collector Base Voltage (VCBO): 40V; Collector Emitter Saturation Voltage: 500mV; Emitter Base Voltage (VEBO): 5V; hFE Min: 40; Max Junction Temperature (Tj): 150°C; Max Power Dissipation: 300mW; Number of Elements: 1; Supplier: DigiKey; Supplier Part Number: 641-1790-6-ND; Manufacturer Part Number: SS8050-G; RoHS: Compliant; Category: BJTs; Stock: 138544; Pricing: 1=0.26, 10=0.157, 100=0.0976, 500=0.0716, 1000=0.06315 (USD); Case/Package: TO-236-3; Collector Emitter Breakdown Voltage: 25V; Collector Emitter Voltage (VCEO): 25V; Height: 1.15mm; Lifecycle Status: Production; Max Breakdown Voltage: 25V; Max Collector Current: 1.5A; Max Operating Temperature: 150°C; Mounting Technology: Surface Mount; Number of Terminals: 3; Power Dissipation: 300mW; REACH SVHC: Yes; Schedule B: 8541100070|8541100070|8541100070|8541100070|8541100070; Transition Frequency: 100MHz; ComponentLink1URL: https://datasheet.octopart.com:443/SS8050-G-Comchip-datasheet-180131983.pdf?src-supplier=IHS; ComponentLink1Description: https://datasheet.octopart.com:443/SS8050-G-Comchip-datasheet-180131983.pdf?src-supplier=IHS; ComponentLink2URL: https://datasheet.octopart.com:443/SS8050-G-Comchip-datasheet-155422643.pdf?src-supplier=Upverter; ComponentLink2Description: https://datasheet.octopart.com:443/SS8050-G-Comchip-datasheet-155422643.pdf?src-supplier=Upverter; ComponentLink3URL: https://datasheet.octopart.com:443/SS8050-G-Comchip-datasheet-189767092.pdf?src-supplier=LCSC; ComponentLink3Description: https://datasheet.octopart.com:443/SS8050-G-Comchip-datasheet-189767092.pdf?src-supplier=LCSC
U1 = ESP32-S3-MINI-1U-N8: WiFi-Module 802.11 2, 4GHz 150Mb/s; Manufacturer: Espressif Systems; Supplier: DigiKey; Supplier Part Number: 1965-ESP32-S3-MINI-1U-N8CT-ND; Manufacturer Part Number: ESP32-S3-MINI-1U-N8; Category: RF Transceiver Modules and Modems; Stock: 744; Pricing: 1=5.43, 10=4.703, 25=4.4492, 100=4.0995, 250=3.89008 (USD); ComponentLink1URL: https://datasheet.octopart.com:443/ESP32-S3-MINI-1U-N8-Espressif-Systems-datasheet-188867343.pdf?src-supplier=TME; ComponentLink1Description: https://datasheet.octopart.com:443/ESP32-S3-MINI-1U-N8-Espressif-Systems-datasheet-188867343.pdf?src-supplier=TME; ComponentLink2URL: https://datasheet.octopart.com:443/ESP32-S3-MINI-1U-N8-Espressif-Systems-datasheet-165560562.pdf?src-supplier=TME; ComponentLink2Description: https://datasheet.octopart.com:443/ESP32-S3-MINI-1U-N8-Espressif-Systems-datasheet-165560562.pdf?src-supplier=TME; ComponentLink3URL: https://datasheet.octopart.com:443/ESP32-S3-MINI-1U-N8-Espressif-Systems-datasheet-165560559.pdf?src-supplier=TME; ComponentLink3Description: https://datasheet.octopart.com:443/ESP32-S3-MINI-1U-N8-Espressif-Systems-datasheet-165560559.pdf?src-supplier=TME
U2 = FT231XQ-R Tape & Reel (TR) 2006 UART USB 2.0 interface controller 3.3V~5V 4mm 8mA 12Mbps UART Interface ICs Tape & Reel (TR) 2006 UART USB 2.0 interface controller 3.3V~5V 4mm 8mA 12Mbps